# Altium schematic sheet 2.SchDoc
size 420 x 297 mm
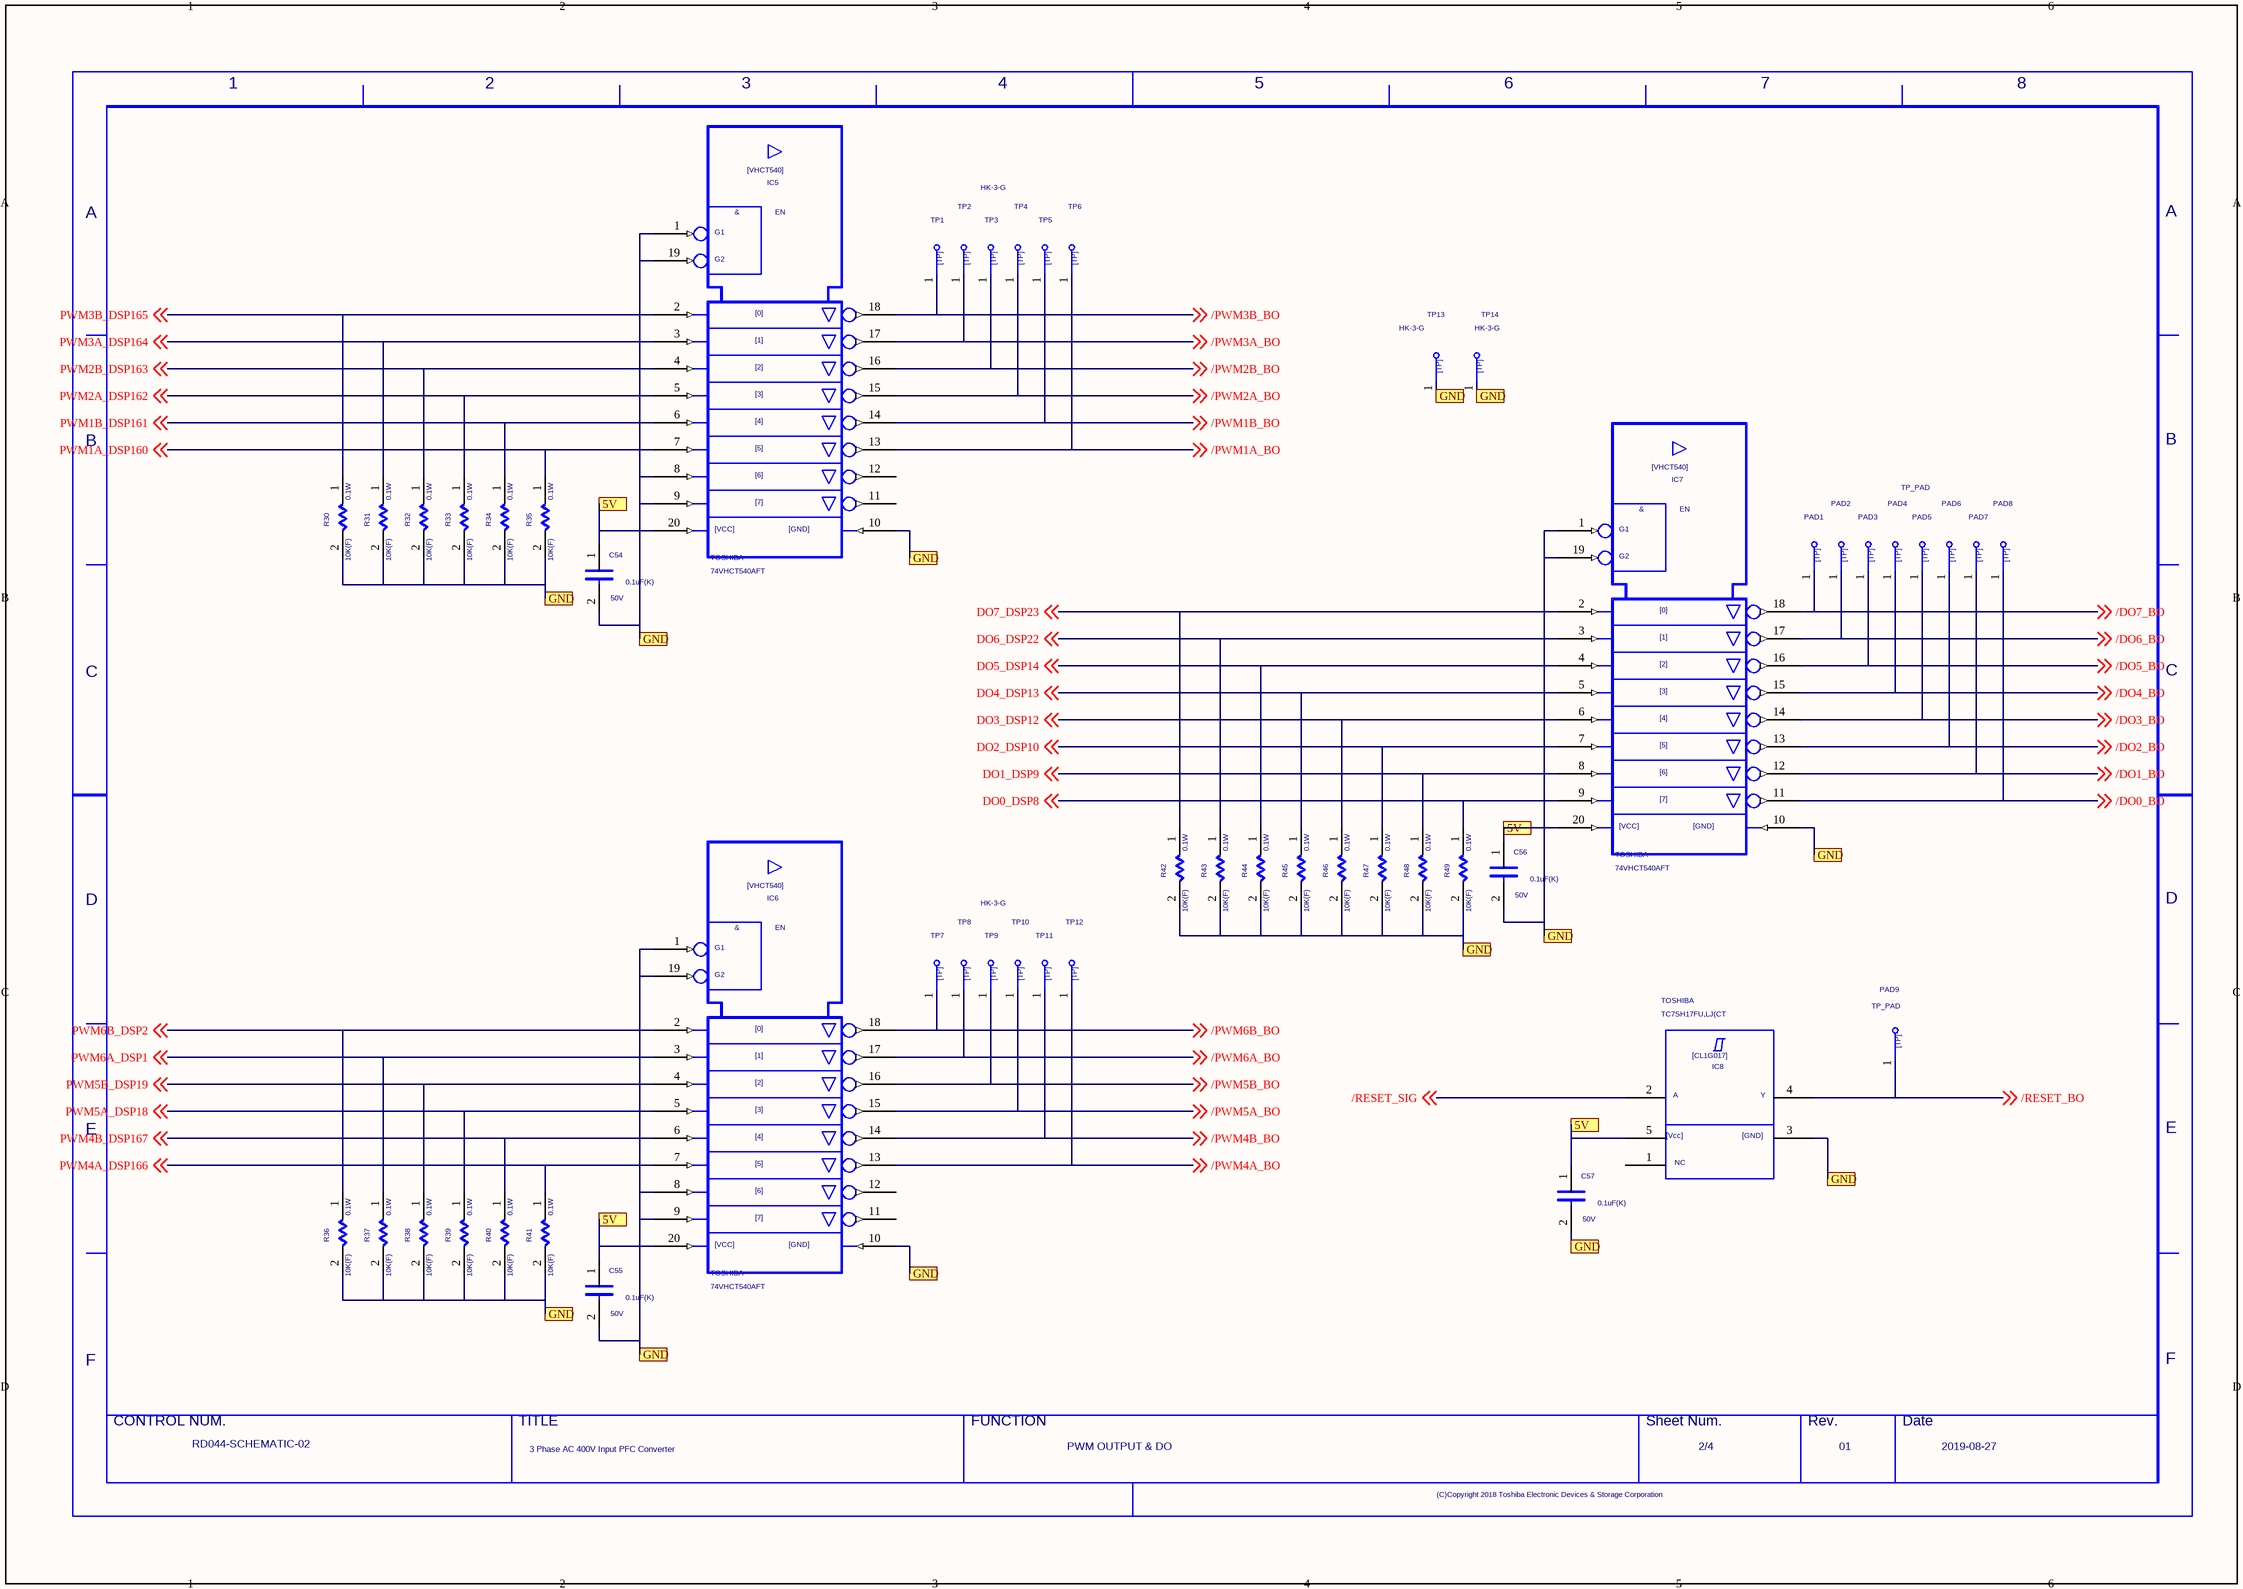
[diagram p0: 2.SchDoc]

## Parts
C54  VAL2: 50V  VAL1: 0.1uF(K)  (hidden comment: C)
C55  VAL2: 50V  VAL1: 0.1uF(K)  (hidden comment: C)
C56  VAL2: 50V  VAL1: 0.1uF(K)  (hidden comment: C)
C57  VAL2: 50V  VAL1: 0.1uF(K)  (hidden comment: C)
IC5  USERCOMPTEXT3: TOSHIBA  VAL3: 74VHCT540AFT  (hidden comment: VHC540)
IC6  USERCOMPTEXT3: TOSHIBA  VAL3: 74VHCT540AFT  (hidden comment: VHC540)
IC7  USERCOMPTEXT3: TOSHIBA  VAL3: 74VHCT540AFT  (hidden comment: VHC540)
IC8  USERCOMPTEXT3: TOSHIBA  VAL3: TC7SH17FU,LJ(CT  (hidden comment: CL1G017)
PAD1  TP  (value not drawn)
PAD2  VAL3: TP_PAD  (hidden comment: TP)
PAD3  TP  (value not drawn)
PAD4  TP  (value not drawn)
PAD5  TP  (value not drawn)
PAD6  TP  (value not drawn)
PAD7  TP  (value not drawn)
PAD8  TP  (value not drawn)
PAD9  VAL3: TP_PAD  (hidden comment: TP)
R30  VAL2: 0.1W  VAL1: 10K(F)  (hidden comment: R)
R31  VAL2: 0.1W  VAL1: 10K(F)  (hidden comment: R)
R32  VAL2: 0.1W  VAL1: 10K(F)  (hidden comment: R)
R33  VAL2: 0.1W  VAL1: 10K(F)  (hidden comment: R)
R34  VAL2: 0.1W  VAL1: 10K(F)  (hidden comment: R)
R35  VAL2: 0.1W  VAL1: 10K(F)  (hidden comment: R)
R36  VAL2: 0.1W  VAL1: 10K(F)  (hidden comment: R)
R37  VAL2: 0.1W  VAL1: 10K(F)  (hidden comment: R)
R38  VAL2: 0.1W  VAL1: 10K(F)  (hidden comment: R)
R39  VAL2: 0.1W  VAL1: 10K(F)  (hidden comment: R)
R40  VAL2: 0.1W  VAL1: 10K(F)  (hidden comment: R)
R41  VAL2: 0.1W  VAL1: 10K(F)  (hidden comment: R)
R42  VAL2: 0.1W  VAL1: 10K(F)  (hidden comment: R)
R43  VAL2: 0.1W  VAL1: 10K(F)  (hidden comment: R)
R44  VAL2: 0.1W  VAL1: 10K(F)  (hidden comment: R)
R45  VAL2: 0.1W  VAL1: 10K(F)  (hidden comment: R)
R46  VAL2: 0.1W  VAL1: 10K(F)  (hidden comment: R)
R47  VAL2: 0.1W  VAL1: 10K(F)  (hidden comment: R)
R48  VAL2: 0.1W  VAL1: 10K(F)  (hidden comment: R)
R49  VAL2: 0.1W  VAL1: 10K(F)  (hidden comment: R)
TP1  TP  (value not drawn)
TP2  VAL3: HK-3-G  (hidden comment: TP)
TP3  TP  (value not drawn)
TP4  TP  (value not drawn)
TP5  TP  (value not drawn)
TP6  TP  (value not drawn)
TP7  TP  (value not drawn)
TP8  VAL3: HK-3-G  (hidden comment: TP)
TP9  TP  (value not drawn)
TP10  TP  (value not drawn)
TP11  TP  (value not drawn)
TP12  TP  (value not drawn)
TP13  VAL3: HK-3-G  (hidden comment: TP)
TP14  VAL3: HK-3-G  (hidden comment: TP)
U?  DATE: 2019-08-27  REVISION: 01  SHEETNUMBER: 2/4  FUNCTION: PWM OUTPUT & DO  TITLE: 3 Phase AC 400V Input PFC Converter  DRAWINGNUMBER: RD044-SCHEMATIC-02  (hidden comment: WAKU_DEF100_2018)

## Ports
5V, GND

## Nets
5V: C54.1 C55.1 C56.1 C57.1 IC5.20 IC6.20 IC7.20 IC8.5 ; port 5V
/DO0_BO: IC7.11 PAD8.1 ; off-sheet /DO0_BO
/DO1_BO: IC7.12 PAD7.1 ; off-sheet /DO1_BO
/DO2_BO: IC7.13 PAD6.1 ; off-sheet /DO2_BO
/DO3_BO: IC7.14 PAD5.1 ; off-sheet /DO3_BO
/DO4_BO: IC7.15 PAD4.1 ; off-sheet /DO4_BO
/DO5_BO: IC7.16 PAD3.1 ; off-sheet /DO5_BO
/DO6_BO: IC7.17 PAD2.1 ; off-sheet /DO6_BO
/DO7_BO: IC7.18 PAD1.1 ; off-sheet /DO7_BO
/PWM1A_BO: IC5.13 TP6.1 ; off-sheet /PWM1A_BO
/PWM1B_BO: IC5.14 TP5.1 ; off-sheet /PWM1B_BO
/PWM2A_BO: IC5.15 TP4.1 ; off-sheet /PWM2A_BO
/PWM2B_BO: IC5.16 TP3.1 ; off-sheet /PWM2B_BO
/PWM3A_BO: IC5.17 TP2.1 ; off-sheet /PWM3A_BO
/PWM3B_BO: IC5.18 TP1.1 ; off-sheet /PWM3B_BO
/PWM4A_BO: IC6.13 TP12.1 ; off-sheet /PWM4A_BO
/PWM4B_BO: IC6.14 TP11.1 ; off-sheet /PWM4B_BO
/PWM5A_BO: IC6.15 TP10.1 ; off-sheet /PWM5A_BO
/PWM5B_BO: IC6.16 TP9.1 ; off-sheet /PWM5B_BO
/PWM6A_BO: IC6.17 TP8.1 ; off-sheet /PWM6A_BO
/PWM6B_BO: IC6.18 TP7.1 ; off-sheet /PWM6B_BO
/RESET_BO: IC8.4 PAD9.1 ; off-sheet /RESET_BO
/RESET_SIG: IC8.2 ; off-sheet /RESET_SIG
DO0_DSP8: IC7.9 R49.1 ; off-sheet DO0_DSP8
DO1_DSP9: IC7.8 R48.1 ; off-sheet DO1_DSP9
DO2_DSP10: IC7.7 R47.1 ; off-sheet DO2_DSP10
DO3_DSP12: IC7.6 R46.1 ; off-sheet DO3_DSP12
DO4_DSP13: IC7.5 R45.1 ; off-sheet DO4_DSP13
DO5_DSP14: IC7.4 R44.1 ; off-sheet DO5_DSP14
DO6_DSP22: IC7.3 R43.1 ; off-sheet DO6_DSP22
DO7_DSP23: IC7.2 R42.1 ; off-sheet DO7_DSP23
GND: C54.2 C55.2 C56.2 C57.2 IC5.1 IC5.8 IC5.9 IC5.10 IC5.19 IC6.1 IC6.8 IC6.9 IC6.10 IC6.19 IC7.1 IC7.10 IC7.19 IC8.3 R30.2 R31.2 R32.2 R33.2 R34.2 R35.2 R36.2 R37.2 R38.2 R39.2 R40.2 R41.2 R42.2 R43.2 R44.2 R45.2 R46.2 R47.2 R48.2 R49.2 TP13.1 TP14.1 ; port GND
PWM1A_DSP160: IC5.7 R35.1 ; off-sheet PWM1A_DSP160
PWM1B_DSP161: IC5.6 R34.1 ; off-sheet PWM1B_DSP161
PWM2A_DSP162: IC5.5 R33.1 ; off-sheet PWM2A_DSP162
PWM2B_DSP163: IC5.4 R32.1 ; off-sheet PWM2B_DSP163
PWM3A_DSP164: IC5.3 R31.1 ; off-sheet PWM3A_DSP164
PWM3B_DSP165: IC5.2 R30.1 ; off-sheet PWM3B_DSP165
PWM4A_DSP166: IC6.7 R41.1 ; off-sheet PWM4A_DSP166
PWM4B_DSP167: IC6.6 R40.1 ; off-sheet PWM4B_DSP167
PWM5A_DSP18: IC6.5 R39.1 ; off-sheet PWM5A_DSP18
PWM5B_DSP19: IC6.4 R38.1 ; off-sheet PWM5B_DSP19
PWM6A_DSP1: IC6.3 R37.1 ; off-sheet PWM6A_DSP1
PWM6B_DSP2: IC6.2 R36.1 ; off-sheet PWM6B_DSP2

Not connected (* = marked no-connect by the designer): IC5 11 12; IC6 11 12; IC8 1

## Notes on the sheet
- (in symbol CL1G017) [CL1G017]; A; Y; [Vcc]; [GND]; NC
- (in symbol TP) [TP]
- (in symbol VHC540) [VHCT540]; &; EN; G1; G2; [0]; [1]; [2]; [3]; [4]; [5]; [6]; [7]; [VCC]; [GND]
- (in symbol WAKU_DEF100_2018) 1; 3; 5; 6; 7; 8; A; B; C; D; E; F; CONTROL NUM.; TITLE; FUNCTION; Sheet Num.; Rev.; Date; (C)Copyright 2018 Toshiba Electronic Devices & Storage Corporation

## Library data of the parts
C54-C57 = C: PARTNAME: C-GRM188R71H104KA93D; OriginalSymbolOrigin: (2540,7620); USERCOMPTEXT1: 1608; COMPONENTTYPE: 4; COMPONENTKIND: 108
IC5-IC7 = VHC540: PARTNAME: IC-74VHCT540AFT; SAVEAREA0: -64373,-927,110287,89788; TIME: 09:37:32; UPDATEUSER: cae; SAVECOUNT: 1; OriginalSymbolOrigin: (7620,83820); COMPONENTTYPE: 4; COMPONENTKIND: 101; AUTHOR: cae; DATE: 2019/07/12; UPDATEDATE: 2019/07/12; UPDATETIME: 09:37:32
IC8 = CL1G017: PARTNAME: IC-TC7SH17F; OUMEPARTTYPE: IC; TIME: 16:09:43; UPDATEUSER: tomizawa-y; UPDATETIME: 12:13:51; SAVECOUNT: 12; SAVEAREA0: -8892,-376,44463,33313; OriginalSymbolOrigin: (7620,30480); MAXGCOUNT: 1; OUMEMAKER: TSB 東芝; MOUNTINGFORMSMD: SMD; FNLEADFREETHET1GT2GMCTH1: 2_0_N; OUMECLASSIFICATION: CMOSロジック; PMPRODUCTSTYPEG: PC1; ADSCNVFLAG: ON; PROCESS: 74VHC; CDMASTERCADCELG: DIC8C8; COMPONENTTYPE: 4; COMPONENTKIND: 101; AUTHOR: e2117910; DATE: 2003/02/06; UPDATEDATE: 2004/03/26; GCOUNT: 1; OUMEMAKERKATAMEI: TC7SH17FU,LJ(CT; VAL1: TC7SH17FU,LJ(CT
PAD1 PAD7 PAD8 = TP: PARTNAME: TP-PAD1.0; TIME: 16:12:21; UPDATEUSER: fukuda-y; UPDATETIME: 16:18:11; SAVECOUNT: 2; SAVEAREA0: -242,-92,12810,7836; OriginalSymbolOrigin: (0,7620); VAL3: TP_PAD; COMPONENTTYPE: 4; COMPONENTKIND: 128; AUTHOR: fukuda-y; DATE: 2006/10/04; UPDATEDATE: 2006/10/04
PAD2 PAD9 = TP: PARTNAME: TP-PAD1.0; TIME: 16:12:21; UPDATEUSER: fukuda-y; UPDATETIME: 16:18:11; SAVECOUNT: 2; SAVEAREA0: -242,-92,12810,7836; OriginalSymbolOrigin: (0,7620); COMPONENTTYPE: 4; COMPONENTKIND: 128; AUTHOR: fukuda-y; DATE: 2006/10/04; UPDATEDATE: 2006/10/04
PAD3-PAD6 = TP: PARTNAME: TP-PAD1.0; TIME: 16:12:21; UPDATEUSER: fukuda-y; UPDATETIME: 16:18:11; SAVECOUNT: 2; SAVEAREA0: -242,-92,12810,7836; OriginalSymbolOrigin: (0,7620); VAL3: HK-3-G; COMPONENTTYPE: 4; COMPONENTKIND: 128; AUTHOR: fukuda-y; DATE: 2006/10/04; UPDATEDATE: 2006/10/04
R30-R49 = R: PARTNAME: R-ERJ3EKF1002V; OriginalSymbolOrigin: (5080,5080); USERCOMPTEXT1: 1608; COMPONENTTYPE: 4; COMPONENTKIND: 105
TP1 TP3-TP7 TP9-TP12 = TP: PARTNAME: TP-HK-3-G; TIME: 16:12:21; UPDATEUSER: fukuda-y; UPDATETIME: 16:18:11; SAVECOUNT: 2; SAVEAREA0: -242,-92,12810,7836; OriginalSymbolOrigin: (0,7620); VAL3: HK-3-G; COMPONENTTYPE: 4; COMPONENTKIND: 128; AUTHOR: fukuda-y; DATE: 2006/10/04; UPDATEDATE: 2006/10/04
TP2 TP8 TP13 TP14 = TP: PARTNAME: TP-HK-3-G; TIME: 16:12:21; UPDATEUSER: fukuda-y; UPDATETIME: 16:18:11; SAVECOUNT: 2; SAVEAREA0: -242,-92,12810,7836; OriginalSymbolOrigin: (0,7620); COMPONENTTYPE: 4; COMPONENTKIND: 128; AUTHOR: fukuda-y; DATE: 2006/10/04; UPDATEDATE: 2006/10/04
U? = WAKU_DEF100_2018: PLOTTIME: HH:MM; SAVEAREA0: -45080,-4508,463680,304612; TIME: 13:54:34; UPDATEUSER: t5459927; UPDATETIME: 12:04:35; SAVECOUNT: 4; OriginalSymbolOrigin: (10160,284480); COMPONENTTYPE: 2; COMPONENTKIND: 0; PLOTDATE: YYYY.MM.DD; AUTHOR: cae; UPDATEDATE: 2019/08/29